# EAGLE design RelayModuleTest (EAGLE 9.6.2)
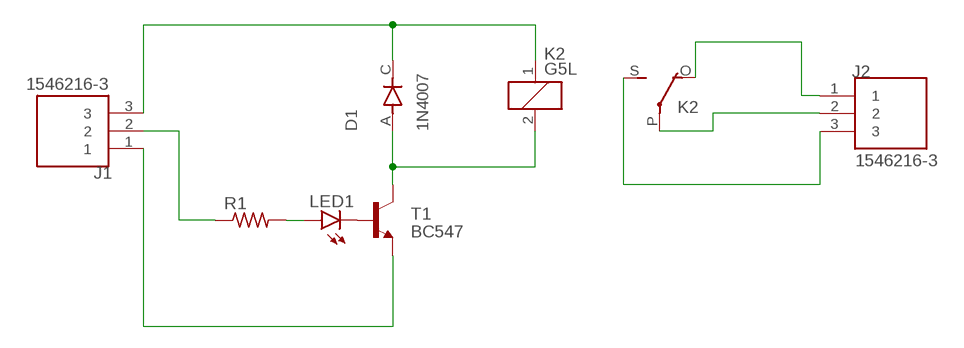
[diagram p0: schematic, sheet 1]

## Parts
D1  1N4007  [DIOAD1060W80L520D270]
J1  1546216-3  [TE_1546216-3]
J2  1546216-3  [TE_1546216-3]
K2  G5L  [G5LE]
LED1  LED3MM  [LED3MM]
R1  R-US_0207/15  [0207/15]
T1  BC547  [TO92]

## Nets
N$1: LED1.K(C) T1.2(B)
N$2: J1.2 R1.1
N$3: LED1.A R1.2
N$4: D1.A K2.2 T1.3(C)
N$5: J1.1 T1.1(E)
N$6: D1.C J1.3 K2.1
N$8: J2.1 K2.O(2:O)
N$9: J2.2 K2.P(2:P)
N$10: J2.3 K2.S(2:S)

## Library data of the parts
D1 = 1N4007:1N4007: Diode Switching 1KV 1A 2-Pin DO-41 Check availability <https://pricing.snapeda.com/parts/1N4007/ON%20Semiconductor/view-part?ref=eda>; AVAILABILITY: In Stock; DESCRIPTION: Diode Standard 1000V 1A Through Hole DO-204AL (DO-41); MF: ON Semiconductor; MP: 1N4007; PACKAGE: DO-41-2 ON Semiconductor; PRICE: None; PURCHASE-URL: https://pricing.snapeda.com/search/part/1N4007/?ref=eda
J1 J2 = terminal-block-3p:1546216-3: Check availability <https://pricing.snapeda.com/parts/1546216-3/TE%20Connectivity/view-part?ref=eda>; AVAILABILITY: In Stock; COMMENT: 1546216-3; DESCRIPTION: 3 Position Wire to Board Terminal Block Horizontal with Board 0.197 (5.00mm) Through Hole; MF: TE Connectivity; MP: 1546216-3; PACKAGE: None; PRICE: None; PURCHASE-URL: https://pricing.snapeda.com/search/part/1546216-3/?ref=eda
K2 = relay:G5L: RELAY 1 x switch, 10 A/120 V AC, 8 A/30 V ADC, Omron; OC_FARNELL: unknown; OC_NEWARK: unknown
LED1 = led:LED: LED OSRAM: - CHIPLED LG R971, LG N971, LY N971, LG Q971, LY Q971, LO R971, LY R971 LH N974, LH R974 LS Q976, LO Q976, LY Q976 LO Q996 - Hyper CHIPLED LW Q18S LB Q993, LB Q99A, LB R99A - SideLED LS A670, LO A670, LY A670, LG A670, LP A670 LB A673, LV A673, LT A673, LW A673 LH A674 LY A675 LS A676, LA A676, LO A676, LY A676, LW A676 LS A679, LY A679, LG A679 - Hyper Micro SIDELED® LS Y876, LA Y876, LO Y876, LY Y876 LT Y87S - SmartLED LW L88C, LW L88S LB L89C, LB L89S, LG L890 LS L89K, LO L89K, LY L89K LS L896, LA L896, LO L896, LY L896 - TOPLED LS T670, LO T670, LY T670, LG T670, LP T670 LSG T670, LSP T670, LSY T670, LOP T670, LYG T670 LG T671, LOG T671, LSG T671 LB T673, LV T673, LT T673, LW T673 LH T674 LS T676, LA T676, LO T676, LY T676, LB T676, LH T676, LSB T676, LW T676 LB T67C, LV T67C, LT T67C, LS T67K, LO T67K, LY T67K, LW E67C LS E67B, LA E67B, LO E67B, LY E67B, LB E67C, LV E67C, LT E67C LW T67C LS T679, LY T679, LG T679 LS T770, LO T770, LY T770, LG T770, LP T770 LB T773, LV T773, LT T773, LW T773 LH T774 LS E675, LA E675, LY E675, LS T675 LS T776, LA T776, LO T776, LY T776, LB T776 LHGB T686 LT T68C, LB T68C - Hyper Mini TOPLED® LB M676 - Mini TOPLED Santana® LG M470 LS M47K, LO M47K, LY M47K Source: http://www.osram.convergy.de LUXEON: - LUMILED® LXK2-PW12-R00, LXK2-PW12-S00, LXK2-PW14-U00, LXK2-PW14-V00 LXK2-PM12-R00, LXK2-PM12-S00, LXK2-PM14-U00 LXK2-PE12-Q00, LXK2-PE12-R00, LXK2-PE12-S00, LXK2-PE14-T00, LXK2-PE14-U00 LXK2-PB12-K00, LXK2-PB12-L00, LXK2-PB12-M00, LXK2-PB14-N00, LXK2-PB14-P00, LXK2-PB14-Q00 LXK2-PR12-L00, LXK2-PR12-M00, LXK2-PR14-Q00, LXK2-PR14-R00 LXK2-PD12-Q00, LXK2-PD12-R00, LXK2-PD12-S00 LXK2-PH12-R00, LXK2-PH12-S00 LXK2-PL12-P00, LXK2-PL12-Q00, LXK2-PL12-R00 Source: www.luxeon.com KINGBRIGHT: KA-3528ASYC Source: www.kingbright.com
R1 = resistor:R-US_: RESISTOR, American symbol
T1 = BC547:BC547: NPN TRANSISTOR Check availability <https://pricing.snapeda.com/parts/BC547/ON/view-part?ref=eda>; AVAILABILITY: In Stock; DESCRIPTION: Bipolar (BJT) Transistor NPN 45 V 100 mA 300MHz 625 mW Through Hole TO-92 (TO-226); MF: ON; MP: BC547; PACKAGE: E-PKG AXIAL-LEADED-2 ON Semiconductor; PRICE: None; PURCHASE-URL: https://pricing.snapeda.com/search/part/BC547/?ref=eda

## Board
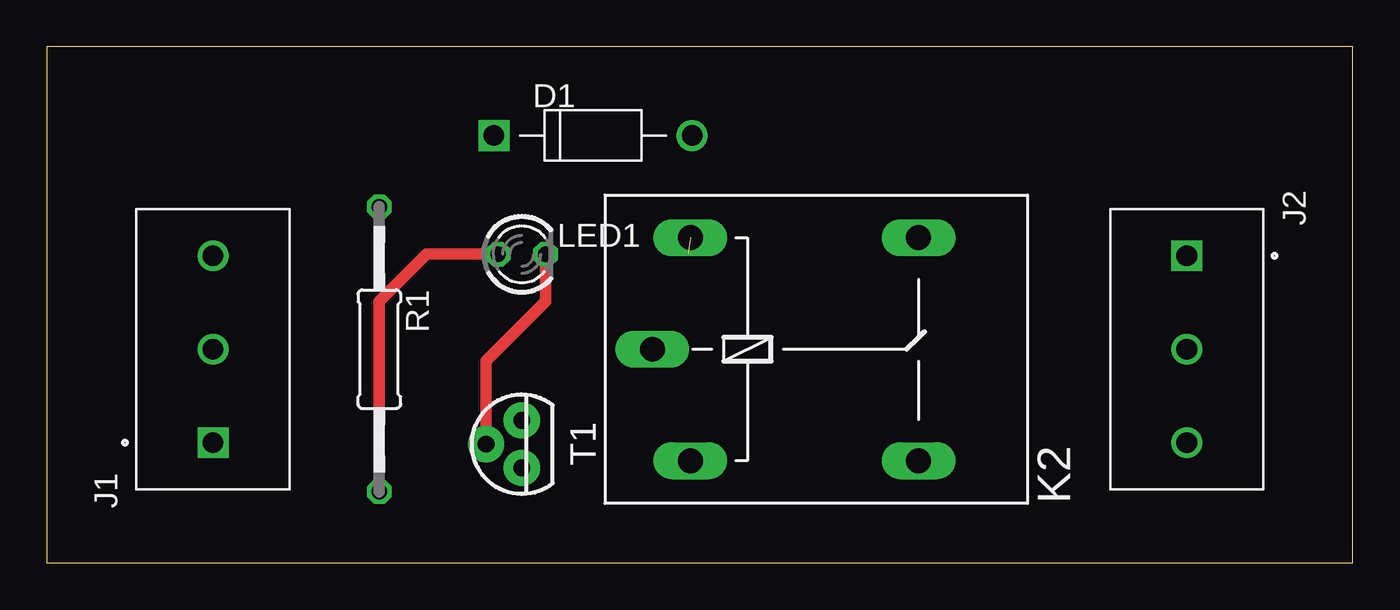
[diagram p1: board, top side]
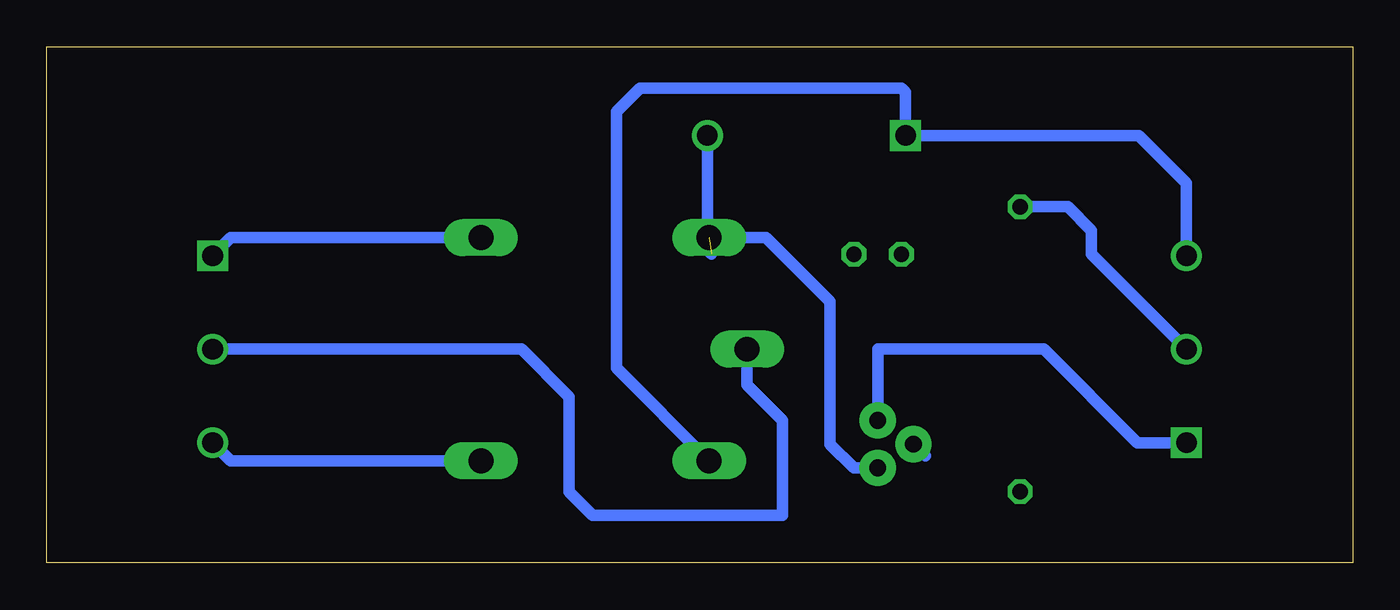
[diagram p2: board, bottom side, seen from below]

Size 69.83 x 27.61 mm. Coordinates in mm from the lower left corner, seen from the top.
Outline: 0,0 69.83,0 69.83,27.61 0,27.61 0,0
Copper layers (1*16): Top 0.035mm / dielectric 1.5mm / Bottom 0.035mm
Design rules "default": minimum track width 6mil, minimum drill 0.35mm, track to track 6mil, track to pad 6mil, pad to pad 6mil, via to via 6mil, smd to smd 6mil, copper to edge 40mil, drill to drill 6mil, minimum pad ring 10mil, minimum via ring 8mil, stop-mask expansion 4mil, vias tented up to drill 0mil, thermal gap 10mil

### Footprints (pad centres in the part's own frame; a part is rotated, then mirrored left to right if it is on the bottom)
DIOAD1060W80L520D270 = drill 1.1 pad 1.65: A 5.3,0 | drill 1.1 pad 1.65 square: C -5.3,0
TE_1546216-3 = drill 1.1 square: 1 -5,0 | drill 1.1: 2 0,0; 3 5,0
G5LE = drill 1.321 long: 1 -7.493,-5.969; 2 -7.493,5.969; O 4.699,5.969; P -9.525,0; S 4.699,-5.969
LED3MM = drill 0.813 octagon: A -1.27,0; K 1.27,0
0207/15 = drill 0.813 octagon: 1 -7.62,0; 2 7.62,0
TO92 = drill 0.9 pad 1.93: 1 1.27,0; 2 0,1.905; 3 -1.27,0

### Placement (x,y rotation side)
D1  29.21,22.86 0 top
J1  8.89,11.43 90 top
J2  60.96,11.43 270 top
K2  41.91,11.43 0 top
LED1  25.4,16.51 0 top
R1  17.78,11.43 270 top
T1  25.4,6.35 90 top

### Tracks (layer width: path | path; a pad name or v marks a point on that pad's centre or on a via)
N$1
  Top 0.61: T1.2 23.49,10.8 26.67,13.97 LED1.K
  Bottom 0.61: 22.86,5.72 T1.2
N$2
  Bottom 0.61: J1.2 13.97,16.51 13.97,17.78 15.24,19.05 R1.1
N$3
  Top 0.61: R1.2 17.78,13.97 20.32,16.51 LED1.A
N$4  (1 unrouted)
  Bottom 0.61: D1.A 34.51,16.73 34.29,16.51 | K2.2 31.37,17.4 27.94,13.97 27.94,6.35 26.67,5.08 T1.3
N$5
  Bottom 0.61: J1.1 11.51,6.43 16.51,11.43 25.4,11.43 T1.1
N$6
  Bottom 0.61: J1.3 8.89,20.32 11.43,22.86 D1.C 23.91,25.18 24.13,25.4 38.1,25.4 39.37,24.13 39.37,10.41 K2.1
N$8
  Bottom 0.61: K2.O 59.99,17.4 J2.1
N$9
  Bottom 0.61: K2.P 32.38,9.53 30.48,7.62 30.48,2.54 40.64,2.54 41.91,3.81 41.91,8.89 44.45,11.43 J2.2
N$10
  Bottom 0.61: K2.S 59.99,5.46 J2.3